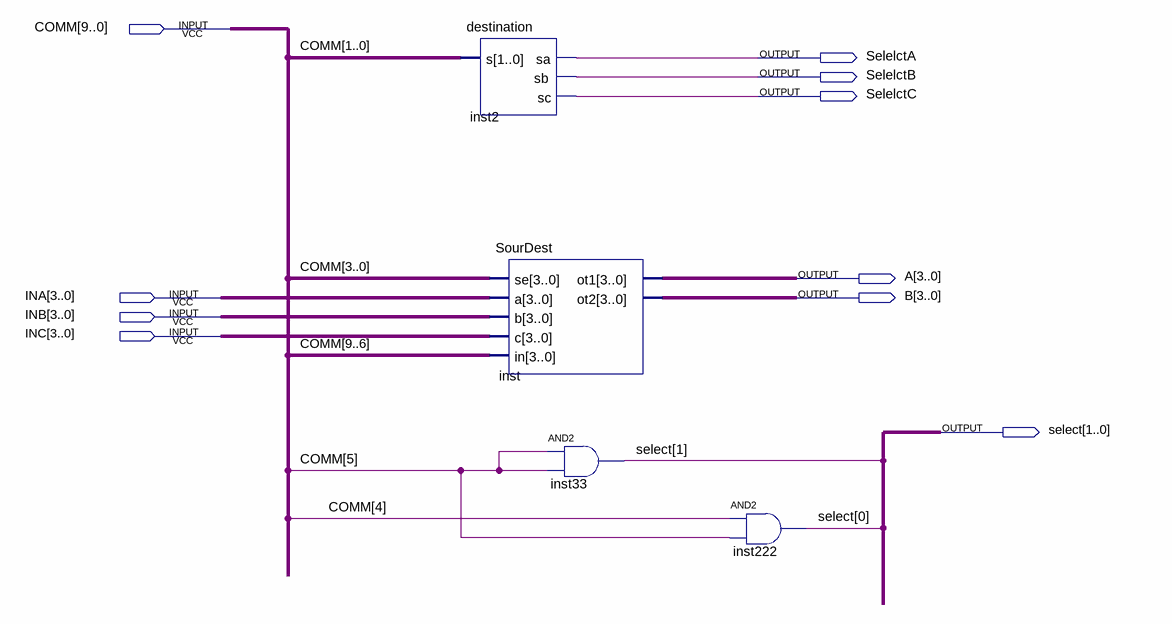
[diagram p0: schematic sheet]
// Quartus schematic decoder.bdf as structural Verilog: 4 symbols, 10 pins
module decoder (
  input  [9:0] COMM,
  input  [3:0] INA,
  input  [3:0] INB,
  input  [3:0] INC,
  output SelelctA,
  output SelelctB,
  output SelelctC,
  output [3:0] A,
  output [3:0] B,
  output [1:0] select
);

  destination inst2 (.s(COMM[1:0]), .sa(SelelctA), .sb(SelelctB), .sc(SelelctC));
  SourDest inst (.se(COMM[3:0]), .a(INA), .b(INB), .c(INC), .in(COMM[9:6]), .ot1(A), .ot2(B));
  and inst33 (select[1], COMM[5], COMM[5]);
  and inst222 (select[0], COMM[4], COMM[5]);
endmodule
